# EAGLE design ArmMount Board 2 (EAGLE 8.0.1)
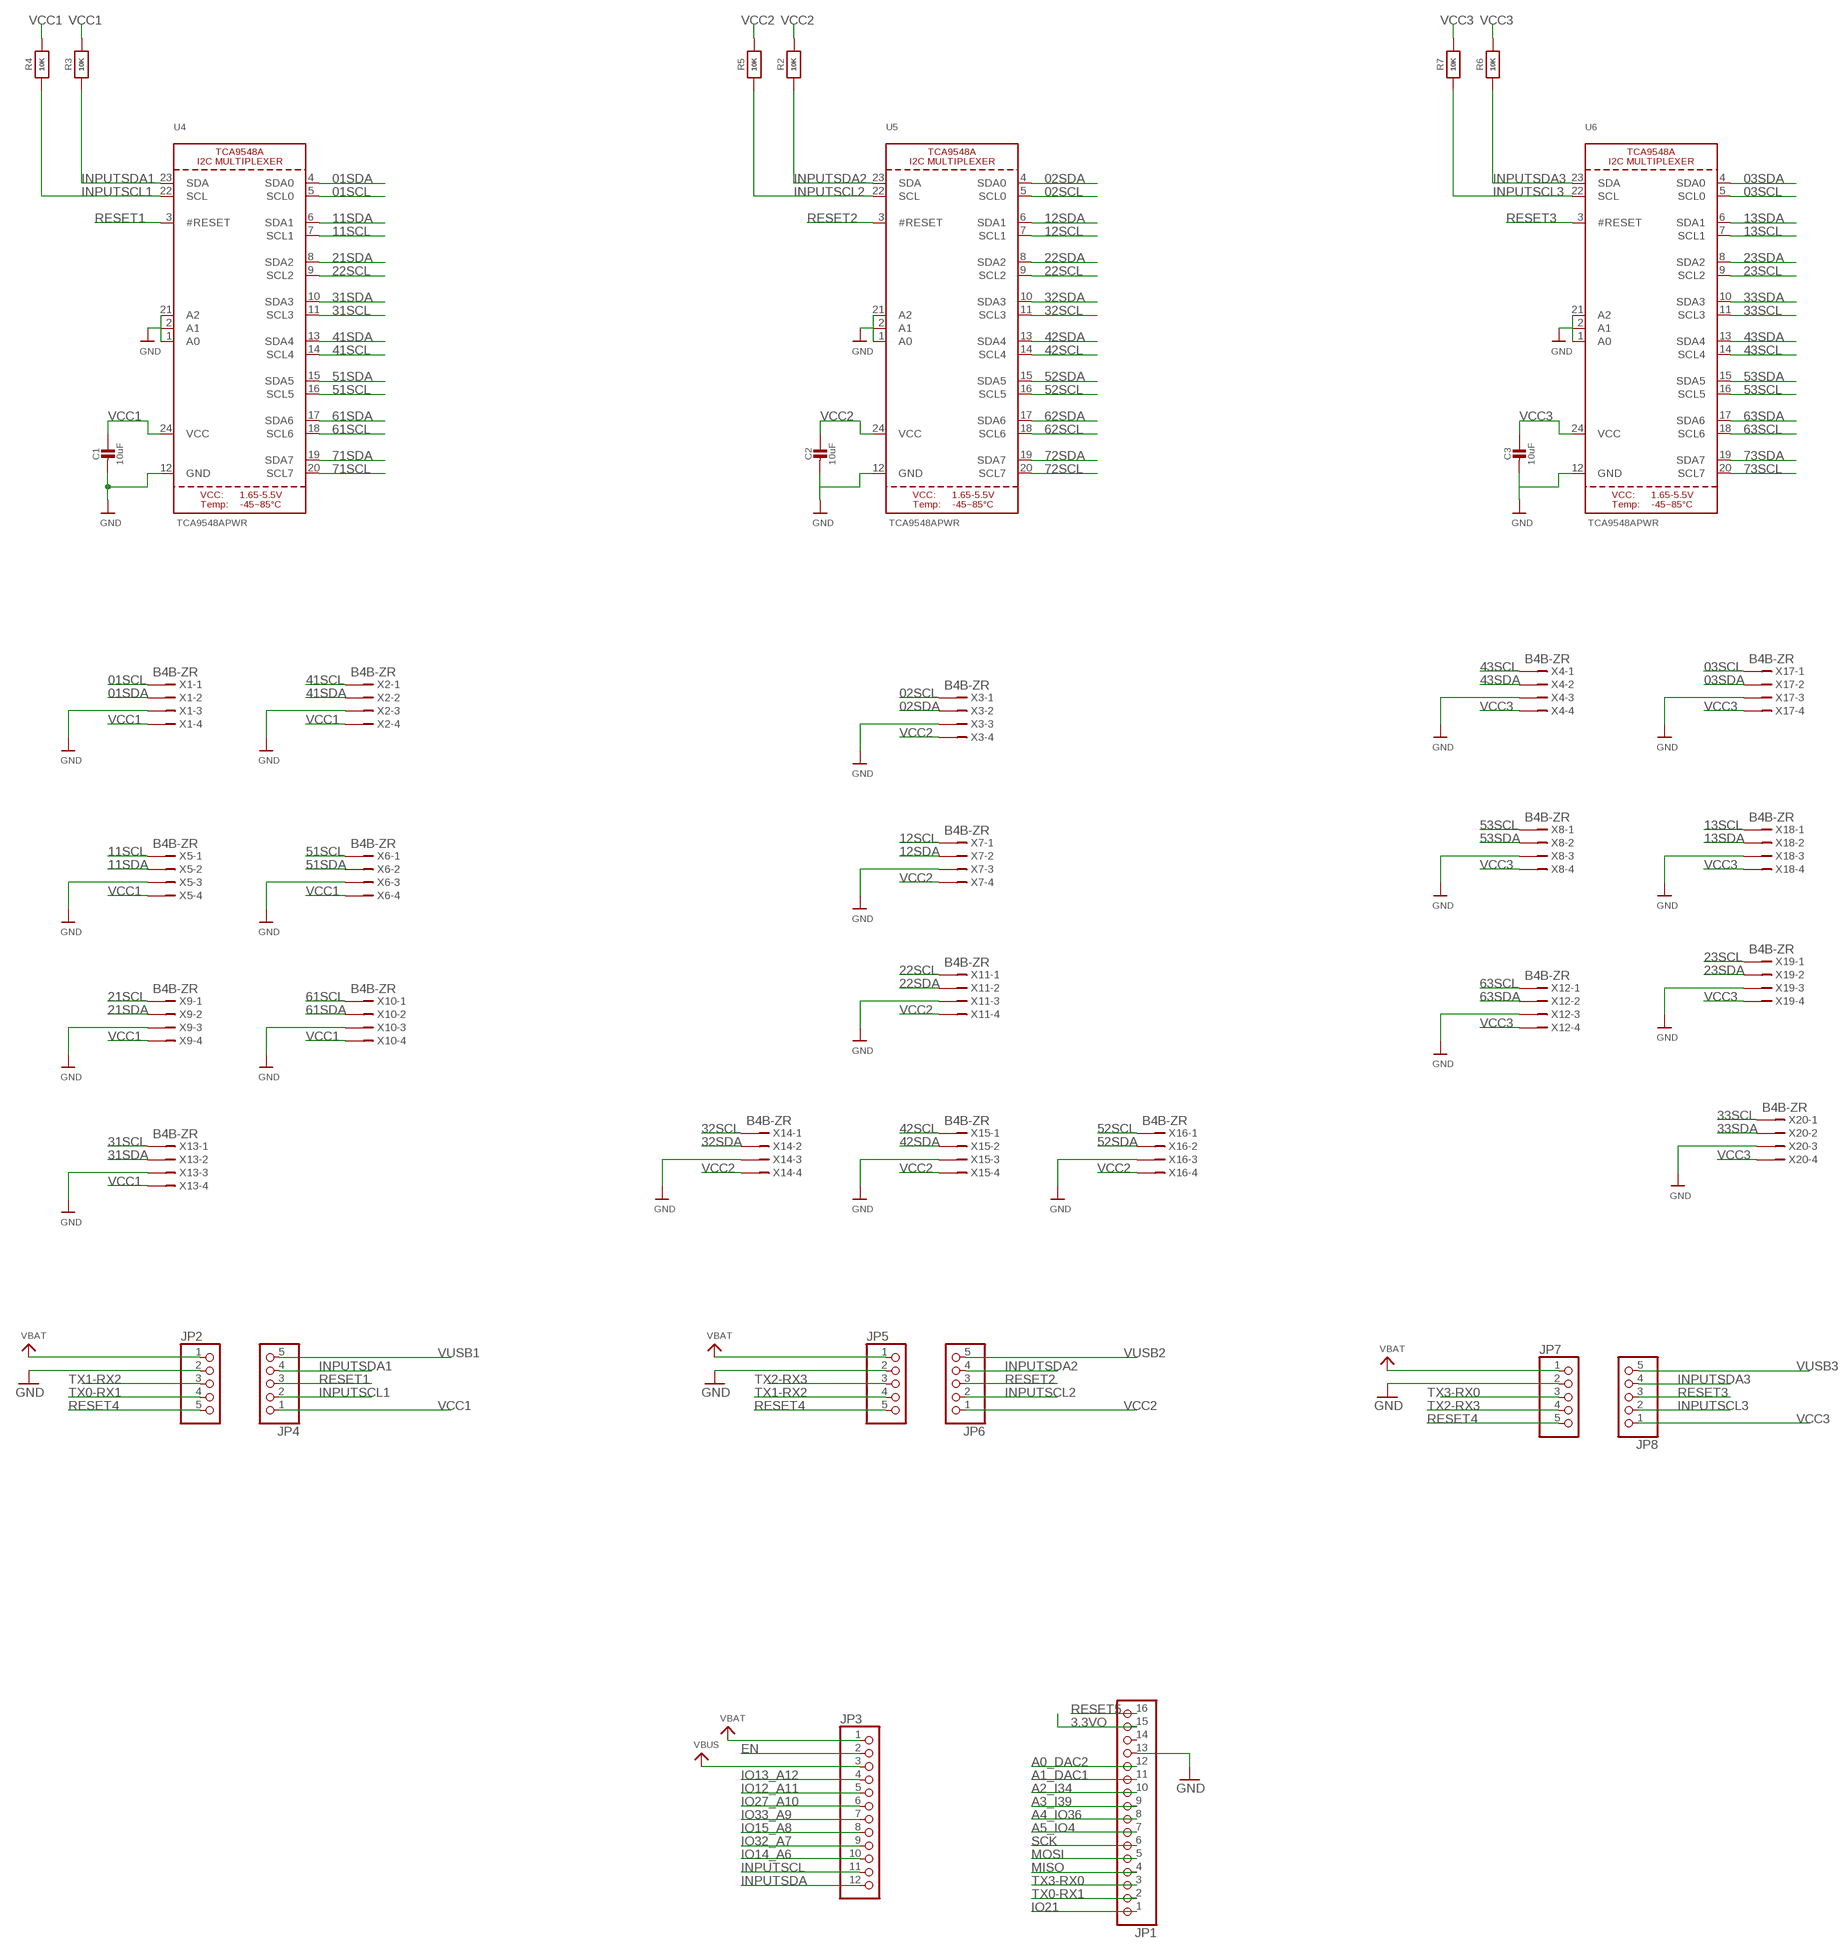
[diagram p0: schematic, sheet 1]

## Parts
C1  10uF  CAP_CERAMIC0805-NOOUTLINE  [0805-NO]
C2  10uF  CAP_CERAMIC0805-NOOUTLINE  [0805-NO]
C3  10uF  CAP_CERAMIC0805-NOOUTLINE  [0805-NO]
JP1  HEADER-1X16_MIN  [1X16_ROUND_MIN]
JP2  HEADER-1X576MIL  [1X05_ROUND_76]
JP3  HEADER-1X12_MIN  [1X12_ROUND_MIN]
JP4  HEADER-1X576MIL  [1X05_ROUND_76]
JP5  HEADER-1X576MIL  [1X05_ROUND_76]
JP6  HEADER-1X576MIL  [1X05_ROUND_76]
JP7  HEADER-1X576MIL  [1X05_ROUND_76]
JP8  HEADER-1X576MIL  [1X05_ROUND_76]
R2  10K  RESISTOR0805_NOOUTLINE  [0805-NO]
R3  10K  RESISTOR0805_NOOUTLINE  [0805-NO]
R4  10K  RESISTOR0805_NOOUTLINE  [0805-NO]
R5  10K  RESISTOR0805_NOOUTLINE  [0805-NO]
R6  10K  RESISTOR0805_NOOUTLINE  [0805-NO]
R7  10K  RESISTOR0805_NOOUTLINE  [0805-NO]
U4  TCA9548APWR  TCA9548A  [TSSOP24]
U5  TCA9548APWR  TCA9548A  [TSSOP24]
U6  TCA9548APWR  TCA9548A  [TSSOP24]
X1  B4B-ZR  [B4B-ZR]
X2  B4B-ZR  [B4B-ZR]
X3  B4B-ZR  [B4B-ZR]
X4  B4B-ZR  [B4B-ZR]
X5  B4B-ZR  [B4B-ZR]
X6  B4B-ZR  [B4B-ZR]
X7  B4B-ZR  [B4B-ZR]
X8  B4B-ZR  [B4B-ZR]
X9  B4B-ZR  [B4B-ZR]
X10  B4B-ZR  [B4B-ZR]
X11  B4B-ZR  [B4B-ZR]
X12  B4B-ZR  [B4B-ZR]
X13  B4B-ZR  [B4B-ZR]
X14  B4B-ZR  [B4B-ZR]
X15  B4B-ZR  [B4B-ZR]
X16  B4B-ZR  [B4B-ZR]
X17  B4B-ZR  [B4B-ZR]
X18  B4B-ZR  [B4B-ZR]
X19  B4B-ZR  [B4B-ZR]
X20  B4B-ZR  [B4B-ZR]

## Nets
01SCL: U4.5(SCL0) X1.1
01SDA: U4.4(SDA0) X1.2
02SCL: U5.5(SCL0) X3.1
02SDA: U5.4(SDA0) X3.2
3.3VO: JP1.15
03SCL: U6.5(SCL0) X17.1
03SDA: U6.4(SDA0) X17.2
11SCL: U4.7(SCL1) X5.1
11SDA: U4.6(SDA1) X5.2
12SCL: U5.7(SCL1) X7.1
12SDA: U5.6(SDA1) X7.2
13SCL: U6.7(SCL1) X18.1
13SDA: U6.6(SDA1) X18.2
21SCL: X9.1
21SDA: U4.8(SDA2) X9.2
22SCL: U4.9(SCL2) U5.9(SCL2) X11.1
22SDA: U5.8(SDA2) X11.2
23SCL: U6.9(SCL2) X19.1
23SDA: U6.8(SDA2) X19.2
31SCL: U4.11(SCL3) X13.1
31SDA: U4.10(SDA3) X13.2
32SCL: U5.11(SCL3) X14.1
32SDA: U5.10(SDA3) X14.2
33SCL: U6.11(SCL3) X20.1
33SDA: U6.10(SDA3) X20.2
41SCL: U4.14(SCL4) X2.1
41SDA: U4.13(SDA4) X2.2
42SCL: U5.14(SCL4) X15.1
42SDA: U5.13(SDA4) X15.2
43SCL: U6.14(SCL4) X4.1
43SDA: U6.13(SDA4) X4.2
51SCL: U4.16(SCL5) X6.1
51SDA: U4.15(SDA5) X6.2
52SCL: U5.16(SCL5) X16.1
52SDA: U5.15(SDA5) X16.2
53SCL: U6.16(SCL5) X8.1
53SDA: U6.15(SDA5) X8.2
61SCL: U4.18(SCL6) X10.1
61SDA: U4.17(SDA6) X10.2
62SCL: U5.18(SCL6)
62SDA: U5.17(SDA6)
63SCL: U6.18(SCL6) X12.1
63SDA: U6.17(SDA6) X12.2
71SCL: U4.20(SCL7)
71SDA: U4.19(SDA7)
72SCL: U5.20(SCL7)
72SDA: U5.19(SDA7)
73SCL: U6.20(SCL7)
73SDA: U6.19(SDA7)
A0_DAC2: JP1.12
A1_DAC1: JP1.11
A2_I34: JP1.10
A3_I39: JP1.9
A4_IO36: JP1.8
A5_IO4: JP1.7
EN: JP3.2
GND: C1.2 C2.2 C3.2 JP1.13 JP2.2 JP5.2 JP7.2 U4.1(A0) U4.2(A1) U4.12(GND) U4.21(A2) U5.1(A0) U5.2(A1) U5.12(GND) U5.21(A2) U6.1(A0) U6.2(A1) U6.12(GND) U6.21(A2) X1.3 X2.3 X3.3 X4.3 X5.3 X6.3 X7.3 X8.3 X9.3 X10.3 X11.3 X12.3 X13.3 X14.3 X15.3 X16.3 X17.3 X18.3 X19.3 X20.3
INPUTSCL: JP3.11
INPUTSCL1: JP4.2 R4.1 U4.22(SCL)
INPUTSCL2: JP6.2 R5.1 U5.22(SCL)
INPUTSCL3: JP8.2 R7.1 U6.22(SCL)
INPUTSDA: JP3.12
INPUTSDA1: JP4.4 R3.1 U4.23(SDA)
INPUTSDA2: JP6.4 R2.1 U5.23(SDA)
INPUTSDA3: JP8.4 R6.1 U6.23(SDA)
IO12_A11: JP3.5
IO13_A12: JP3.4
IO14_A6: JP3.10
IO15_A8: JP3.8
IO21: JP1.1
IO27_A10: JP3.6
IO32_A7: JP3.9
IO33_A9: JP3.7
MISO: JP1.4
MOSI: JP1.5
RESET1: JP4.3 U4.3(#RESET)
RESET2: JP6.3 U5.3(#RESET)
RESET3: JP8.3 U6.3(#RESET)
RESET4: JP2.5 JP5.5 JP7.5
RESET5: JP1.16
SCK: JP1.6
TX0-RX1: JP1.2 JP2.4
TX1-RX2: JP2.3 JP5.4
TX2-RX3: JP5.3 JP7.4
TX3-RX0: JP1.3 JP7.3
VBAT: JP2.1 JP3.1 JP5.1 JP7.1
VBUS: JP3.3
VCC1: C1.1 JP4.1 R3.2 R4.2 U4.24(VCC) X1.4 X2.4 X5.4 X6.4 X9.4 X10.4 X13.4
VCC2: C2.1 JP6.1 R2.2 R5.2 U5.24(VCC) X3.4 X7.4 X11.4 X14.4 X15.4 X16.4
VCC3: C3.1 JP8.1 R6.2 R7.2 U6.24(VCC) X4.4 X8.4 X12.4 X17.4 X18.4 X19.4 X20.4
VUSB1: JP4.5
VUSB2: JP6.5
VUSB3: JP8.5
Unconnected: JP1.14

## Library data of the parts
C1-C3 = microbuilder:CAP_CERAMIC: Ceramic Capacitors For new designs, use the packages preceded by an '_' character since they are more reliable: The following footprints should be used on most boards: _0402 - Standard footprint for regular board layouts _0603 - Standard footprint for regular board layouts _0805 - Standard footprint for regular board layouts _1206 - Standard footprint for regular board layouts For extremely tight-pitch boards where space is at a premium, the following 'micro-pitch' footprints can be used (smaller pads, no silkscreen outline, etc.): _0402MP - Micro-pitch footprint for very dense/compact boards _0603MP - Micro-pitch footprint for very dense/compact boards _0805MP - Micro-pitch footprint for very dense/compact boards _1206MP - Micro-pitch footprint for very dense/compact boards
JP1 = microbuilder:HEADER-1X16: PIN HEADER
JP2 JP4-JP8 = microbuilder:HEADER-1X5: PIN HEADER
JP3 = microbuilder:HEADER-1X12
R2-R7 = microbuilder:RESISTOR: Resistors For new designs, use the packages preceded by an '_' character since they are more reliable: The following footprints should be used on most boards: _0402 - Standard footprint for regular board layouts _0603 - Standard footprint for regular board layouts _0805 - Standard footprint for regular board layouts _1206 - Standard footprint for regular board layouts For extremely tight-pitch boards where space is at a premium, the following 'micro-pitch' footprints can be used (smaller pads, no silkscreen outline, etc.): _0402MP - Micro-pitch footprint for very dense/compact boards _0603MP - Micro-pitch footprint for very dense/compact boards _0805MP - Micro-pitch footprint for very dense/compact boards _1206MP - Micro-pitch footprint for very dense/compact boards
U4-U6 = microbuilder:TCA9548A: TCA9548A I2C Multiplexer
X1-X20 = con-jst:?4B-ZR: ZH CONNECTOR 1.5 mm, 4 pin 1 row Source: http://www.jst.com .. eZH.pdf; MF: FARNELL; MPN: B4B-ZR(LF)(SN); OC_FARNELL: 1830916; OC_NEWARK: 37K9960

## Board
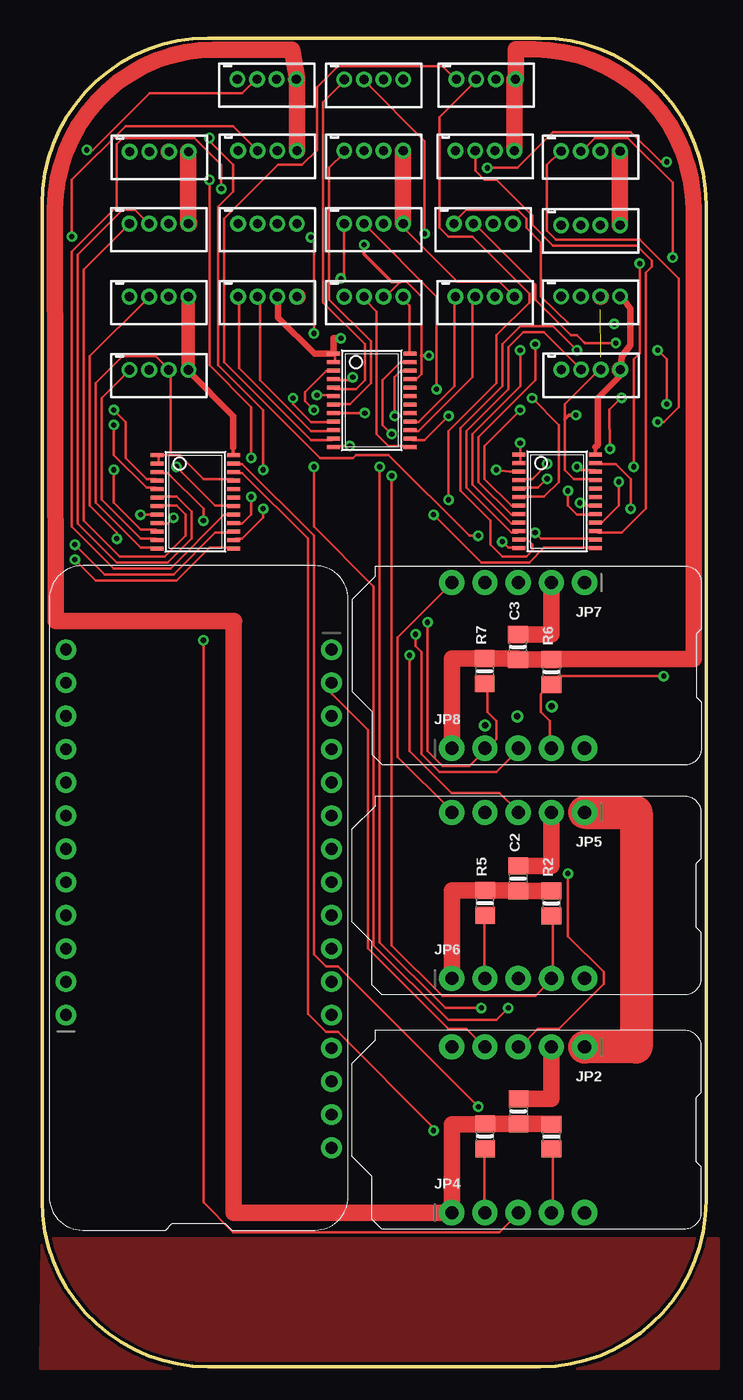
[diagram p1: board, top side]
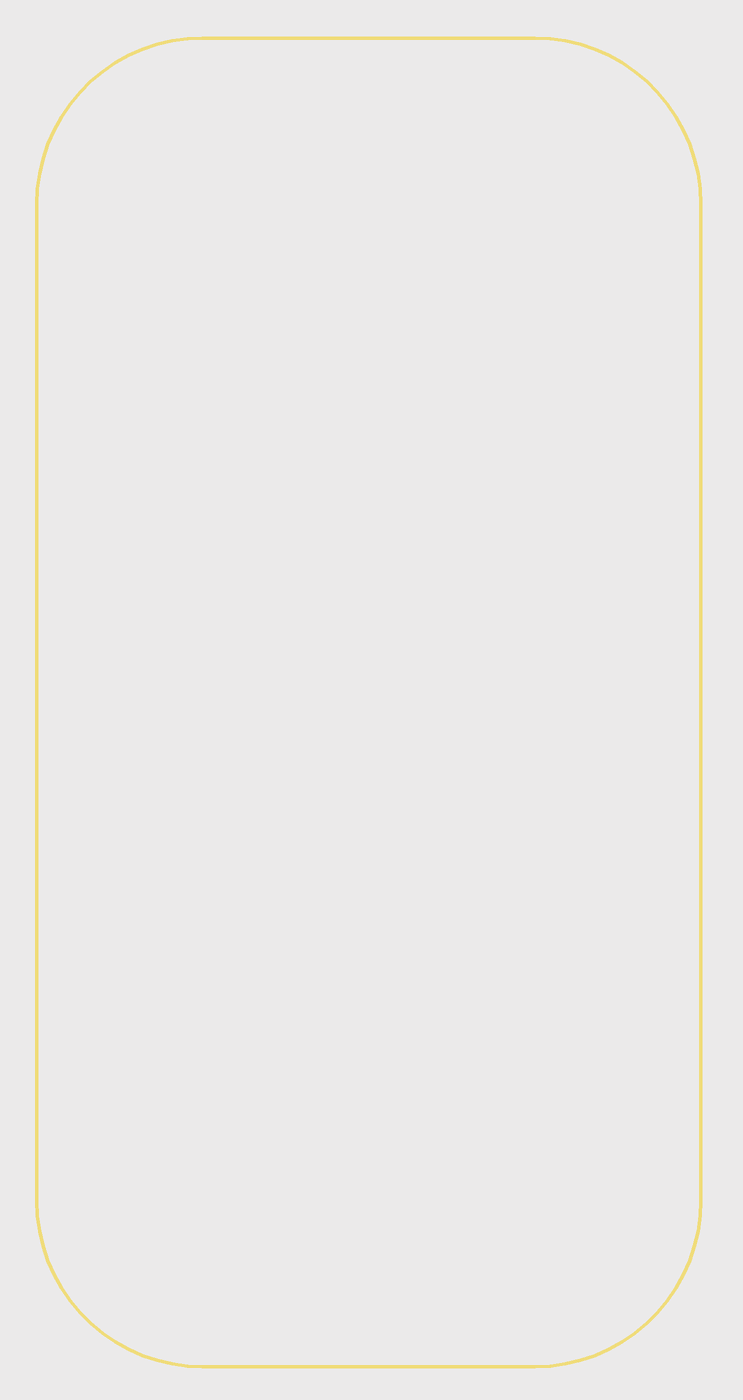
[diagram p2: board, bottom side, seen from below]

Size 50.8 x 101.6 mm. Coordinates in mm from the lower left corner, seen from the top.
Outline: 12.7,0 38.1,0 arc90 50.8,12.7 50.8,88.9 arc90 38.1,101.6 12.7,101.6 arc90 0,88.9 0,12.7 arc90 12.7,0
Copper layers (1*16): Top 0.035mm / dielectric 1.5mm / Bottom 0.035mm
Design rules "adafruit *": minimum track width 8mil, minimum drill 15.5mil, track to track 10mil, track to pad 10mil, pad to pad 10mil, via to via 10mil, smd to smd 8mil, copper to edge 10mil, drill to drill 8mil, minimum pad ring 10mil, minimum via ring 8mil, stop-mask expansion 2mil, vias tented up to drill 20mil, thermal gap 10mil

### Footprints (pad centres in the part's own frame; a part is rotated, then mirrored left to right if it is on the bottom)
0805-NO = smd 1.3 x 1.5: 1 -0.95,0; 2 0.95,0
1X16_ROUND_MIN = drill 0.9 pad 1.575: 1 -19.05,0; 2 -16.51,0; 3 -13.97,0; 4 -11.43,0; 5 -8.89,0; 6 -6.35,0; 7 -3.81,0; 8 -1.27,0; 9 1.27,0; 10 3.81,0; 11 6.35,0; 12 8.89,0; 13 11.43,0; 14 13.97,0; 15 16.51,0; 16 19.05,0
1X05_ROUND_76 = drill 1 pad 1.93: 1 -5.08,0; 2 -2.54,0; 3 0,0; 4 2.54,0; 5 5.08,0
1X12_ROUND_MIN = drill 0.9 pad 1.575: 1 -13.97,0; 2 -11.43,0; 3 -8.89,0; 4 -6.35,0; 5 -3.81,0; 6 -1.27,0; 7 1.27,0; 8 3.81,0; 9 6.35,0; 10 8.89,0; 11 11.43,0; 12 13.97,0
TSSOP24 = smd 0.305 x 0.991: 1 -3.575,-2.918; 2 -2.925,-2.918; 3 -2.275,-2.918; 4 -1.625,-2.918; 5 -0.975,-2.918; 6 -0.325,-2.918; 7 0.325,-2.918; 8 0.975,-2.918; 9 1.625,-2.918; 10 2.275,-2.918; 11 2.925,-2.918; 12 3.575,-2.918; 13 3.575,2.918; 14 2.925,2.918; 15 2.275,2.918; 16 1.625,2.918; 17 0.975,2.918; 18 0.325,2.918; 19 -0.325,2.918; 20 -0.975,2.918; 21 -1.625,2.918; 22 -2.275,2.918; 23 -2.925,2.918; 24 -3.575,2.918
B4B-ZR = drill 0.7 pad 1.1: 1 -2.25,0; 2 -0.75,0; 3 0.75,0; 4 2.25,0

### Placement (x,y rotation side)
C1  36.45,19.53 90 top
C2  36.42,37.34 90 top
C3  36.4,55.04 90 top
JP1  22.15,35.79 270 top
JP2  36.42,24.46 180 top
JP3  1.83,40.87 90 top
JP4  36.42,11.79 0 top
JP5  36.42,42.39 180 top
JP6  36.42,29.69 0 top
JP7  36.42,59.97 180 top
JP8  36.42,47.29 0 top
R2  38.96,35.43 90 top
R3  38.96,17.6 90 top
R4  33.88,17.63 90 top
R5  33.88,35.46 90 top
R6  38.96,53.14 90 top
R7  33.86,53.19 90 top
U4  11.73,66.14 270 top
U5  25.22,73.89 270 top
U6  39.4,66.17 270 top
X1  8.97,92.91 0 top
X2  17.2,98.45 0 top
X3  25.37,98.42 0 top
X4  33.96,98.45 0 top
X5  8.94,87.4 0 top
X6  17.25,92.99 0 top
X7  25.37,92.99 0 top
X8  33.88,92.99 0 top
X9  8.94,81.81 0 top
X10  17.25,87.4 0 top
X11  25.37,87.4 0 top
X12  33.76,87.4 0 top
X13  8.94,76.23 0 top
X14  17.25,81.81 0 top
X15  25.37,81.81 0 top
X16  33.88,81.81 0 top
X17  41.96,92.94 0 top
X18  41.96,87.3 0 top
X19  41.96,81.84 0 top
X20  41.99,76.25 0 top

### Tracks (layer width: path | path; a pad name or v marks a point on that pad's centre or on a via)
01SCL  (via drill 0.39)
  Top 0.203: v5.49,72.01 5.49,69.72 8,67.21 8.69,67.21 U4.5
  Bottom 0.203: v5.49,72.01 3.2,74.3 3.2,89.15 6.86,92.81 X1.1
01SDA  (via drill 0.39)
  Top 0.203: v5.49,73.15 6.4,72.24 6.4,69.49 8,67.89 8.69,67.89 U4.4
  Bottom 0.203: v5.49,73.15 3.66,74.98 3.66,88.7 5.03,90.07 5.26,90.07 8,92.81 X1.2
02SCL
  Top 0.203: U5.5 22.4,74.75 24,74.75 24.69,75.44 24.69,78.18 21.49,81.38 21.49,96.7 23.09,98.3 X3.1
02SDA  (via drill 0.39)
  Top 0.203: v23.77,75.67 23.55,75.44 22.4,75.44 U5.4 | v29.26,86.64 29.26,93.73 24.69,98.3 X3.2
  Bottom 0.203: v23.77,75.67 28.57,80.47 28.57,81.38 28.8,81.61 28.8,86.18 v29.26,86.64
03SCL  (via drill 0.39)
  Top 0.203: v38.63,67.89 37.95,67.21 36.58,67.21 U6.5 | v47.09,72.24 47.55,72.24 48.69,73.38 48.69,83.21 45.72,86.18 39.32,86.18 38.63,86.87 38.63,91.9 39.55,92.81 X17.1
  Bottom 0.203: v38.63,67.89 42.98,72.24 v47.09,72.24
03SDA  (via drill 0.39)
  Top 0.203: v38.63,69.04 37.49,67.89 36.58,67.89 U6.4 | v48.23,84.81 48.23,90.53 44.81,93.95 42.29,93.95 41.38,93.04 X17.2
  Bottom 0.203: v38.63,69.04 39.09,69.04 43.2,73.15 45.49,73.15 48.23,75.89 v48.23,84.81
11SCL
  Top 0.203: U4.7 8.91,65.84 10.29,65.84 10.97,65.15 10.97,63.55 9.37,61.95 5.94,61.95 3.2,64.69 3.2,83.9 6.63,87.33 X5.1
11SDA
  Top 0.203: U4.6 8.91,66.52 10.29,66.52 11.43,65.38 11.43,63.32 9.6,61.49 5.71,61.49 2.74,64.47 2.74,85.04 6.17,88.47 7.09,88.47 8,87.55 X5.2
12SCL
  Top 0.203: U5.7 22.4,73.61 23.55,73.61 25.15,75.21 25.15,78.41 21.95,81.61 21.95,91.67 23.09,92.81 X7.1
12SDA  (via drill 0.39)
  Top 0.203: v21.03,74.3 22.17,74.3 U5.6 | v20.8,79.02 20.8,86.41 v20.57,86.36
  Bottom 0.203: v21.03,74.3 21.03,78.41 v20.8,79.02 | v20.57,86.36 20.57,89.15 23.32,91.9 23.55,91.9 24.23,92.58 24.23,92.81 24.46,93.04 X7.2
13SCL  (via drill 0.39)
  Top 0.203: v36.58,73.15 33.83,70.41 33.83,67.89 35.89,65.84 36.35,65.84 U6.7
  Bottom 0.203: v36.58,73.15 36.58,74.3 35.2,75.67 35.2,78.64 36.8,80.24 36.8,80.92 37.26,81.38 37.26,82.07 36.8,82.53 36.8,82.98 37.03,83.21 37.03,83.44 37.72,84.12 37.72,84.81 39.55,86.64 39.55,87.1 X18.1
13SDA  (via drill 0.39)
  Top 0.203: v37.49,74.07 39.55,72.01 39.55,67.67 38.41,66.52 36.58,66.52 U6.6
  Bottom 0.203: v37.49,74.07 35.66,75.89 35.66,78.18 37.26,79.78 37.26,80.7 38.63,82.07 38.63,82.3 39.09,82.75 39.09,83.44 38.18,84.35 41.15,87.33 X18.2
21SDA  (via drill 0.39)
  Top 0.203: v7.54,65.15 8.69,65.15 U4.8 | v5.71,63.32 5.71,63.78 3.66,65.84 3.66,77.27 8,81.61 X9.2
  Bottom 0.203: v5.71,63.32 v7.54,65.15
22SCL  (via drill 0.39)
  Top 0.203: v10.06,64.92 9.6,64.47 8.91,64.47 U4.9 | v19.2,74.07 19.2,73.61 20.57,72.24 22.17,72.24 U5.9 | v22.86,83.21 23.09,83.44 23.09,87.33 X11.1
  Bottom 0.203: v10.06,64.92 v19.2,74.07 18.75,74.52 18.75,78.87 19.89,80.01 19.89,80.24 v22.86,83.21
22SDA  (via drill 0.39)
  Top 0.203: v24.69,72.92 22.4,72.92 U5.8 | v30.18,74.75 30.18,81.84 24.69,87.33 X11.2
  Bottom 0.203: v24.69,72.92 26.06,72.92 26.75,73.61 29.03,73.61 30.86,71.78 31.32,71.78 32,72.47 32,72.92 v30.18,74.75
23SCL  (via drill 0.39)
  Top 0.203: v36.58,77.72 36.58,74.98 32.92,71.32 32.92,67.44 35.89,64.47 36.35,64.47 U6.9
  Bottom 0.203: v36.58,77.72 36.58,78.18 37.72,79.32 37.95,79.32 38.86,80.24 38.86,80.47 39.55,81.15 39.55,81.84 X19.1
23SDA  (via drill 0.39)
  Top 0.203: v37.72,78.18 37.72,75.44 33.38,71.09 33.38,67.67 35.89,65.15 36.35,65.15 U6.8
  Bottom 0.203: v37.72,78.18 37.49,78.41 37.95,78.87 38.18,78.87 41.15,81.84 X19.2
31SCL
  Top 0.203: U4.11 8.69,63.32 7.54,63.32 4.57,66.29 4.57,74.07 6.63,76.12 X13.1
31SDA  (via drill 0.39)
  Top 0.203: v5.49,68.58 5.49,66.06 7.54,64.01 8.69,64.01 U4.10
  Bottom 0.203: v5.49,68.58 5.49,70.87 6.4,71.78 6.4,73.61 7.09,74.3 7.09,75.21 8,76.12 X13.2
32SCL
  Top 0.203: U5.11 22.17,70.87 20.57,70.87 15.09,76.35 15.09,81.61 X14.1
32SDA
  Top 0.203: U5.10 22.17,71.55 20.57,71.55 16.69,75.44 16.69,81.61 X14.2
33SCL  (via drill 0.39)
  Top 0.203: v40.92,77.72 39.09,79.55 36.58,79.55 35.2,78.18 35.2,74.98 32,71.78 32,66.98 34.29,64.69 34.29,62.87 35.2,61.95 37.03,61.95 37.49,62.41 37.49,62.87 37.03,63.32 36.58,63.32 U6.11
  Bottom 0.203: v40.92,77.72 39.55,76.35 X20.1
33SDA
  Top 0.203: U6.10 36.35,63.78 35.89,63.78 32.46,67.21 32.46,71.55 35.66,74.75 35.66,77.95 36.8,79.1 38.41,79.1 41.15,76.35 X20.2
41SCL  (via drill 0.39)
  Top 0.203: v16.92,65.61 16.92,64.92 15.32,63.32 14.86,63.32 U4.14 | v16.92,68.58 16.92,73.15 13.49,76.58 13.49,88.7 14.63,89.84 14.63,91.9 12.8,93.73 v12.8,93.95
  Bottom 0.203: v16.92,68.58 v16.92,65.61 | v12.8,93.95 12.34,94.41 12.34,95.56 15.09,98.3 X2.1
41SDA  (via drill 0.39)
  Top 0.203: v2.52,61.72 4.12,60.12 10.29,60.12 12.8,62.64 14.63,62.64 U4.13 | v3.43,93.04 3.89,93.04 8.23,97.38 15.32,97.38 16.23,98.3 X2.2
  Bottom 0.203: v2.52,61.72 1.14,63.09 1.14,86.41 2.74,88.01 2.74,90.75 3.43,91.44 v3.43,93.04
42SCL  (via drill 0.39)
  Top 0.203: v31.09,72.69 29.26,70.87 28.35,70.87 U5.14
  Bottom 0.203: v31.09,72.69 29.03,74.75 23.55,74.75 21.72,76.58 21.72,79.32 23.55,81.15 23.09,81.61 X15.1
42SDA
  Top 0.203: U5.13 28.12,70.41 26.52,70.41 25.6,71.32 25.6,80.7 24.69,81.61 X15.2
43SCL  (via drill 0.39)
  Top 0.203: v37.72,63.78 38.18,63.32 42.29,63.32 U6.14 | v33.38,63.55 32.69,63.55 26.52,69.72 24,69.72 23.77,69.49 21.26,69.49 13.95,76.81 13.95,87.78 18.06,91.9 19.89,91.9 21.03,93.04 21.03,97.84 22.63,99.44 30.63,99.44 31.55,98.53 X4.1
  Bottom 0.203: v37.72,63.78 37.49,64.01 33.83,64.01 v33.38,63.55
43SDA  (via drill 0.39)
  Top 0.203: v29.95,65.15 33.6,61.49 37.26,61.49 38.41,62.64 42.29,62.64 U6.13 | v31.09,66.29 31.09,71.55 34.75,75.21 34.75,78.87 37.26,81.38 37.26,82.07 32.92,86.41 31.09,86.41 30.4,87.1 30.4,95.56 33.15,98.3 X4.2
  Bottom 0.203: v31.09,66.29 v29.95,65.15
51SCL  (via drill 0.39)
  Top 0.203: v16,66.52 16,65.15 15.32,64.47 14.86,64.47 U4.16 | v16,69.49 16,73.38 12.8,76.58 v12.8,90.75
  Bottom 0.203: v16,69.49 v16,66.52 | v12.8,90.75 13.26,90.75 14.86,92.35 14.86,92.81 X6.1
51SDA  (via drill 0.39)
  Top 0.203: v2.52,62.87 4.8,60.58 10.06,60.58 13.26,63.78 14.63,63.78 U4.15 | v2.29,86.41 2.29,90.75 6.4,94.87 14.63,94.87 16.46,93.04 X6.2
  Bottom 0.203: v2.52,62.87 2.52,86.18 v2.29,86.41
52SCL
  Top 0.203: U5.16 28.35,72.24 28.8,72.24 31.55,74.98 31.55,81.61 X16.1
52SDA
  Top 0.203: U5.15 28.35,71.55 28.8,71.55 32.92,75.67 32.92,81.61 X16.2
53SCL  (via drill 0.39)
  Top 0.203: v44.12,67.67 44.12,65.84 42.75,64.47 42.52,64.47 U6.16 | v45.26,68.81 45.26,77.04 45.72,77.5 v45.72,84.35 | v47.78,92.13 47.32,92.13 45.03,94.41 39.09,94.41 36.35,91.67 v34.06,91.67
  Bottom 0.203: v45.26,68.81 v44.12,67.67 | v45.72,84.35 45.72,87.33 46.63,88.24 46.63,90.07 46.41,90.3 46.41,90.75 v47.78,92.13 | v34.06,91.67 33.83,91.9 32.69,91.9 32,92.58 31.77,92.58 31.55,92.81 X8.1
53SDA
  Top 0.203: U6.15 42.52,63.78 44.35,63.78 46.18,65.61 46.18,83.67 46.63,84.12 46.63,84.58 45.49,85.72 39.09,85.72 37.49,87.33 37.49,88.01 34.75,90.75 33.83,90.75 33.15,91.44 33.15,92.81 X8.2
61SCL  (via drill 0.39)
  Top 0.203: v10.29,68.81 13.26,65.84 14.63,65.84 U4.18
  Bottom 0.203: v10.29,68.81 10.29,70.87 14.4,74.98 14.4,77.95 12.12,80.24 12.12,81.15 12.34,81.38 12.34,84.35 14.86,86.87 14.86,87.33 X10.1
61SDA  (via drill 0.39)
  Top 0.203: v13.72,90.07 13.72,91.9 11.66,93.95 6.17,93.95 5.71,93.5 5.71,88.7 2.29,85.27 2.29,64.24 5.49,61.04 9.83,61.04 13.95,65.15 14.63,65.15 U4.17
  Bottom 0.203: v13.72,90.07 16.46,87.33 X10.2
63SCL  (via drill 0.39)
  Top 0.203: v41.15,66.06 41.38,65.84 42.29,65.84 U6.18 | v47.78,73.61 47.78,77.04 v47.09,77.72 | X12.1 31.55,87.55 32.46,88.47 36.35,88.47 37.03,87.78 37.03,87.1 38.18,85.95 38.18,81.84 40.32,79.72 40.34,79.73 v43.76,79.73
  Bottom 0.203: v41.15,66.06 46.41,71.32 47.32,71.32 48.23,72.24 48.23,73.15 v47.78,73.61 | v47.09,77.72 45.72,79.1 45.26,79.1 44.63,79.73 v43.76,79.73
63SDA  (via drill 0.39)
  Top 0.203: v40.23,66.98 40.23,65.84 40.92,65.15 42.29,65.15 U6.17 | v43.43,70.18 43.41,73.18 v44.32,74.09 | X12.2 33.15,87.33 37.72,82.75 37.72,81.61 40.46,78.87 40.92,78.87 41.44,78.35 41.5,78.28 v43.89,78.28
  Bottom 0.203: v43.43,70.18 v40.23,66.98 | v44.32,74.09 44.81,75.21 44.81,75.44 45.26,75.89 45.26,77.04 v43.89,78.28
GND  (via drill 0.38, 0.39)  (1 unrouted)
  Top 0.203: 8.91,69.72 8.91,69.04 U4.2 | 8.91,69.72 9.83,69.72 | 9.83,69.72 10.52,69.72 12.34,67.89 14.63,67.89 U4.21 | 8.91,69.72 U4.1 | U4.12 8.69,62.64 7.54,62.64 4.12,66.06 4.12,75.21 6.17,77.27 8.69,77.27 9.6,76.35 X13.3 9.83,76.12 9.83,69.72 | U6.21 42.29,67.89 40.69,67.89 40.01,68.58 40.01,72.47 40.01,73.61 42.52,76.12 X20.3 | U5.2 22.4,76.81 22.4,77.5 U5.1 22.17,77.5 20.8,77.5 18.06,80.24 18.06,81.61 18.03,81.72 X14.3 | U5.21 28.35,75.44 28.57,75.44 29.03,75.89 29.03,77.32 29.03,81.84 27.89,82.98 27.43,82.98 26.29,81.84 X15.3 | 36.58,69.72 36.58,69.04 U6.2 | v23.55,70.41 22.4,70.41 U5.12 | v35.2,63.09 35.66,62.64 36.35,62.64 U6.12 | v36.58,70.64 36.58,69.72 | 36.58,69.72 U6.1
  Top 0.254: v29.59,77.32 29.03,77.32 | 27.43,82.98 26.72,82.98 24.64,85.06 v24.64,85.8 | v40.84,72.77 40.31,72.77 40.01,72.47
  Top 0.508: v22.86,78.64 22.3,78.64 U5.1 20.83,77.46 18.06,80.24 18.06,81.68 18.03,81.72
  Top 1.27: C1.2 38.96,20.48 JP2.2 | C2.2 38.96,38.29 JP5.2 | C3.2 38.96,55.99 JP7.2 | X1.3 9.69,92.91 | X19.3 42.74,81.84
  Bottom 0.203: X9.3 9.83,81.61 9.83,81.38 9.69,80.8 | X5.3 9.6,87.55 9.6,87.78 9.69,88.42 | X10.3 18.06,87.33 18.06,86.87 18,86.39 | X1.3 9.83,92.81 9.83,92.35 9.72,91.9 | X6.3 18.06,93.04 18.06,93.5 18,94 | X16.3 34.75,81.84 34.75,82.3 34.63,82.76 | X2.3 18.06,98.3 18.06,98.07 17.95,97.44 | X11.3 26.06,87.55 26.06,87.78 26.12,88.42 | X7.3 26.06,92.81 26.06,92.58 26.11,92.13 26.12,91.97 | X12.3 34.52,87.33 34.52,86.87 34.51,86.39 | X3.3 26.06,98.53 26.06,99.44 25.83,99.89 | X8.3 34.75,93.04 34.75,93.5 34.63,94.13 | X19.3 42.75,81.84 42.75,81.38 42.71,80.82 | X18.3 42.75,87.33 42.75,87.78 42.71,88.31 | X4.3 34.75,98.3 34.75,98.07 34.71,97.44 | X17.3 42.75,92.81 42.75,92.35 42.71,91.92 | X15.3 26.06,81.61 26.06,81.38 26.12,80.8 | X14.3 18.06,81.84 18.06,82.3 18,82.76 | X20.3 42.75,76.35 42.75,76.58 42.74,77.19 | X13.3 9.83,76.12 9.83,75.89 9.69,75.28
  Bottom 0.254: v24.64,85.8 24.64,85.92 X11.3
  Bottom 1.016: X3.3 26.06,98.42 26.06,97.48 26.04,97.48 26.04,92.99 X7.3 | X11.3 26.11,87.4 26.11,89.38 | 26.11,89.38 26.11,92.13 | X12.3 34.51,88.33 34.27,88.57 34.27,89.13 33.76,89.64 26.36,89.64 26.11,89.38
  pour Bottom (isolate 0.508): 0,101.6 50.8,101.6 50.8,0 0.08,0 0.08,-0.03 0,0.13 0.03,0.13 0.03,2.72
INPUTSCL1  (via drill 0.39)
  Top 0.203: v29.95,18.06 29.95,18.29 22.63,25.6 21.72,25.6 20.34,26.98 20.34,63.32 15.32,68.35 14.86,68.35 U4.22 | R4.1 33.83,16.46 33.83,11.89 JP4.2
  Bottom 0.203: v29.95,18.06 33.83,14.17 33.83,11.89 JP4.2
INPUTSCL2  (via drill 0.39)
  Top 0.203: v26.98,72.69 26.98,75.67 27.43,76.12 28.12,76.12 U5.22 | v25.83,68.81 25.83,32.46 30.86,27.43 v33.6,27.43 | R5.1 33.83,34.29 33.83,29.72 JP6.2
  Bottom 0.203: v26.98,72.69 25.83,71.55 v25.83,68.81 | v33.6,27.43 33.83,27.66 33.83,29.49 JP6.2
INPUTSCL3  (via drill 0.39)
  Top 0.203: v40.92,68.81 41.15,68.58 42.29,68.58 U6.22 | v29.49,56.92 29.49,47.09 30.63,45.95 32.69,45.95 33.83,47.09 JP8.2 34.06,47.32 34.75,48.01 34.75,49.38 34.06,50.06 34.06,52.12 R7.1
  Bottom 0.203: v40.92,68.81 36.58,64.47 31.32,64.47 29.95,63.09 29.72,63.09 27.89,61.27 27.89,58.52 v29.49,56.92
INPUTSDA1  (via drill 0.39)
  Top 0.203: v33.38,19.89 22.63,30.63 21.72,30.63 20.8,31.55 20.8,63.55 15.32,69.04 14.86,69.04 U4.23 | R3.1 39.09,16.46 39.09,11.89 JP4.4
  Bottom 0.203: v33.38,19.89 38.86,14.4 38.86,11.89 JP4.4
INPUTSDA2  (via drill 0.39)
  Top 0.203: v26.75,71.32 26.06,72.01 26.06,75.44 27.43,76.81 28.12,76.81 U5.23 | v26.75,68.12 26.75,32.23 30.63,28.35 37.72,28.35 38.86,29.49 JP6.4 39.09,29.72 39.09,34.29 R2.1
  Bottom 0.203: v26.75,68.12 v26.75,71.32
INPUTSDA3  (via drill 0.39)
  Top 0.203: v45.03,65.61 45.03,67.89 43.89,69.04 42.52,69.04 U6.23 | v47.55,52.81 39.55,52.81 39.09,52.35 R6.1 38.86,52.12 38.18,51.44 38.18,50.06 38.86,49.38 38.86,47.32 JP8.4
  Bottom 0.203: v45.03,65.61 48.69,61.95 48.69,53.95 v47.55,52.81
N$1  (via drill 0.51)
  other vias: 38.99,50.5
N$2  (via drill 0.51)
  other vias: 33.88,49.05
N$3  (via drill 0.51)
  other vias: 36.35,49.73
N$4
  Bottom 1.27: 19.43,98.48 arc90 19.48,98.53 19.1,100.66
N$5
  pour Top: -0.1,-0.1 51.74,-0.1 51.74,9.78 0,9.78
RESET1  (via drill 0.39)
  Top 0.203: v12.34,64.69 12.34,65.61 9.6,68.35 8.91,68.35 U4.3 | v12.34,55.55 12.34,12.57 14.63,10.29 34.98,10.29 36.35,11.66 JP4.3
  Bottom 0.203: v12.34,55.55 v12.34,64.69
RESET2  (via drill 0.39)
  Top 0.203: v20.8,73.15 20.12,73.84 20.12,74.52 21.72,76.12 22.17,76.12 U5.3 | v20.8,68.81 20.8,64.24 25.38,59.66 25.38,32.23 31.09,26.52 34.75,26.52 v35.66,27.43
  Bottom 0.203: v20.8,68.81 v20.8,73.15 | v35.66,27.43 36.58,28.35 36.35,28.57 36.35,29.49 JP6.3
RESET3  (via drill 0.39)
  Top 0.203: v34.75,68.58 35.76,68.45 U6.3 | v28.57,56.01 28.57,55.09 29.03,54.63 29.03,46.86 30.4,45.49 34.75,45.49 36.35,47.09 JP8.3
  Bottom 0.203: v34.75,68.58 29.72,63.55 29.49,63.55 27.43,61.49 27.43,57.15 v28.57,56.01
RESET4
  Top 0.203: JP7.5 31.32,59.89 27.2,55.78 27.2,46.63 31.32,42.52 JP5.5
  Bottom 0.203: JP2.5 30.86,24.46 27.89,27.43 27.89,37.72 31.55,41.38 31.55,42.29 JP5.5
TX0-RX1
  Top 0.203: JP1.2 22.17,52.12 22.17,51.44 24.92,48.69 24.92,32 31.09,25.83 32.46,25.83 33.83,24.46 JP2.4
TX1-RX2  (via drill 0.39)
  Top 0.203: v40.23,37.72 40.23,32.92 42.98,30.18 42.98,29.26 39.55,25.83 37.95,25.83 36.58,24.46 JP2.3
  Bottom 0.203: v40.23,37.72 36.12,37.72 33.83,40.01 33.83,42.29 JP5.4
TX2-RX3  (via drill 0.39)
  Top 0.203: v28.12,54.41 28.12,47.09 31.32,43.89 34.98,43.89 36.35,42.52 JP5.3
  Bottom 0.203: v28.12,54.41 30.4,56.69 30.4,56.92 33.38,59.89 33.83,59.89 JP7.4
TX3-RX0
  Bottom 0.203: JP1.3 22.17,49.61 24.69,49.61 31.55,56.46 35.2,56.46 36.58,57.84 36.58,58.52 36.35,58.75 36.58,58.98 36.58,59.89 JP7.3
VBAT
  Top 2.54: JP5.1 45.44,42.39 45.44,24.46 JP2.1
  Bottom 2.54: JP3.1 12.01,26.9 12.01,5.41 45.44,5.41 45.44,24.46 JP2.1 | 45.44,42.39 45.44,59.82 41.5,59.82 JP7.1 | JP5.1 45.44,42.39 | 45.44,42.39 45.44,41.99
VCC1
  Top 0.203: U4.24 14.63,69.72 | 11.2,76.12 X13.4 11.2,76.35 | 11.2,81.61 X9.4
  Top 0.254: 14.63,70.28 14.63,69.74 U4.24
  Top 0.508: 11.2,76.12 14.63,72.69 14.63,70.28
  Top 1.016: X9.4 X13.4
  Top 1.27: R3.2 38.96,18.58 C1.1 R4.2 33.88,18.54 31.34,18.54 JP4.1 14.66,11.79 14.66,57.02 | 11.27,87.48 arc-90 X5.4 11.19,92.91 X1.4 | X6.4 19.5,98.45 X2.4 arc90 19.51,98.51 19.13,100.71 13.18,100.71 arc90 0.99,88.52 1.07,57.02 14.66,57.02 | 14.71,57.02 14.66,57.02
  Bottom 1.27: 11.25,92.86 X1.4 11.22,100.71 19.1,100.71 19.48,98.45 X2.4 | X5.4 X9.4 | X6.4 X10.4
VCC2
  Top 0.203: U5.24 28.12,77.5 28.12,81.15 27.66,81.61 X15.4 | X11.4 27.89,86.87 31.77,82.98 34.98,82.98 36.12,81.84 X16.4
  Top 1.27: JP6.1 31.34,36.42 33.88,36.42 R5.2 36.42,36.41 C2.1 R2.2 | X14.4 19.53,81.81 | X7.4 X11.4
  Bottom 0.203: 27.62,84.58 25.38,84.58 25.15,84.81 22.17,84.81 21.95,84.58 21.49,84.58 19.66,82.75 19.66,81.84 X14.4
  Bottom 1.27: X15.4 27.62,84.58 X11.4 | X7.4 X3.4 27.61,100.69 37.64,100.69 arc-90 49.84,88.49 49.84,36.4 31.29,36.4 31.29,29.69 JP6.1
VCC3
  Top 0.203: U6.24 42.52,69.72 | 44.12,75.67 X20.4 | 44.35,81.84 X19.4
  Top 0.254: 42.34,70.31 42.34,69.77 U6.24
  Top 0.508: 44.12,75.67 42.52,74.07 42.52,70.48 42.34,70.31 | 44.35,81.84 45.01,80.9 45.01,78.13 44.35,77.24 X20.4
  Top 1.27: JP8.1 31.34,54.15 33.86,54.15 R7.2 36.4,54.14 C3.1 R6.2 38.96,54.13 49.84,54.13 49.84,88.54 arc90 37.64,100.74 36.25,100.74 36.25,98.49 arc-90 X4.4 36.13,98.45 X8.4 | X20.4 44.21,76.25 | X17.4 X18.4
  Bottom 1.27: X8.4 36.01,92.99 X12.4 | X18.4 X19.4 | X4.4 44.21,98.45 X17.4